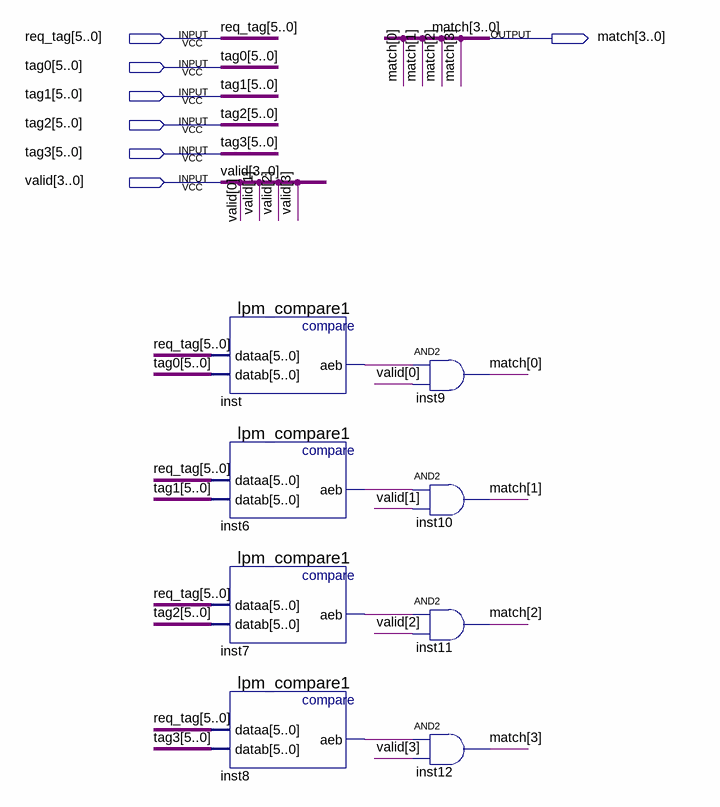
[diagram p0: schematic sheet]
// Quartus schematic tag_compare_4.bdf as structural Verilog: 8 symbols, 7 pins
module tag_compare_4 (
  input  [5:0] req_tag,
  input  [5:0] tag0,
  input  [5:0] tag1,
  input  [5:0] tag2,
  input  [5:0] tag3,
  input  [3:0] valid,
  output [3:0] match
);

  wire inst6_aeb, inst7_aeb, inst8_aeb, inst_aeb;

  lpm_compare1 inst (.dataa(req_tag), .datab(tag0), .aeb(inst_aeb));
  lpm_compare1 inst6 (.dataa(req_tag), .datab(tag1), .aeb(inst6_aeb));
  lpm_compare1 inst7 (.dataa(req_tag), .datab(tag2), .aeb(inst7_aeb));
  lpm_compare1 inst8 (.dataa(req_tag), .datab(tag3), .aeb(inst8_aeb));
  and inst9 (match[0], inst_aeb, valid[0]);
  and inst10 (match[1], inst6_aeb, valid[1]);
  and inst11 (match[2], inst7_aeb, valid[2]);
  and inst12 (match[3], inst8_aeb, valid[3]);
endmodule
